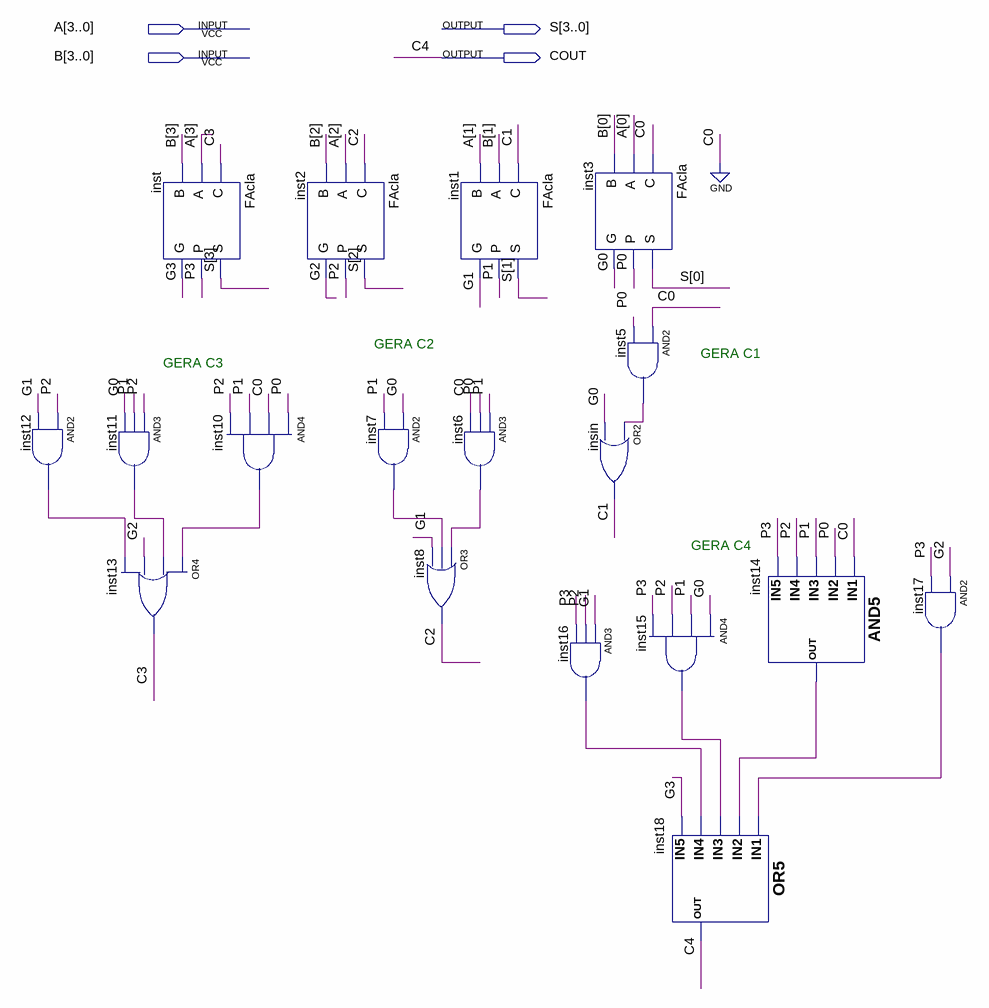
[diagram p0: schematic sheet]
// Quartus schematic CLA.bdf as structural Verilog: 18 symbols, 4 pins
module CLA (
  input  [3:0] A,
  input  [3:0] B,
  output [3:0] S,
  output COUT
);

  wire C1, C2, C3, G0, G1, G2, G3, inst5_out, inst6_out, inst7_out, inst10_out, inst11_out, inst12_out,
       inst14_out, inst15_out, inst16_out, inst17_out, P0, P1, P2, P3;

  and inst12 (inst12_out, P2, G1);
  and inst11 (inst11_out, P2, P1, G0);
  or inst13 (C3, inst10_out, inst11_out, G2, inst12_out);
  FAcla inst (.C(C3), .A(A[3]), .B(B[3]), .S(S[3]), .P(P3), .G(G3));
  and inst10 (inst10_out, P0, 1'b0, P1, P2);
  FAcla inst2 (.C(C2), .A(A[2]), .B(B[2]), .S(S[2]), .P(P2), .G(G2));
  and inst7 (inst7_out, G0, P1);
  or inst8 (C2, inst6_out, inst7_out, G1);
  FAcla inst1 (.C(C1), .A(B[1]), .B(A[1]), .S(S[1]), .P(P1), .G(G1));
  and inst6 (inst6_out, P1, P0, 1'b0);
  FAcla inst3 (.C(1'b0), .A(A[0]), .B(B[0]), .S(S[0]), .P(P0), .G(G0));
  or insin (C1, inst5_out, G0);
  and inst16 (inst16_out, G1, P2, P3);
  and inst5 (inst5_out, 1'b0, P0);
  and inst15 (inst15_out, G0, P1, P2, P3);
  or inst18 (COUT, inst17_out, inst14_out, inst15_out, inst16_out, G3);
  and inst14 (inst14_out, 1'b0, P0, P1, P2, P3);
  and inst17 (inst17_out, G2, P3);

  // Other names for the same wires on the sheet: C4 = COUT

  // Notes on the sheet:
  //   GERA C2
  //   GERA C1
  //   GERA C3
  //   GERA C4
endmodule
